# EAGLE design nano_board_v0 (EAGLE 9.6.2)
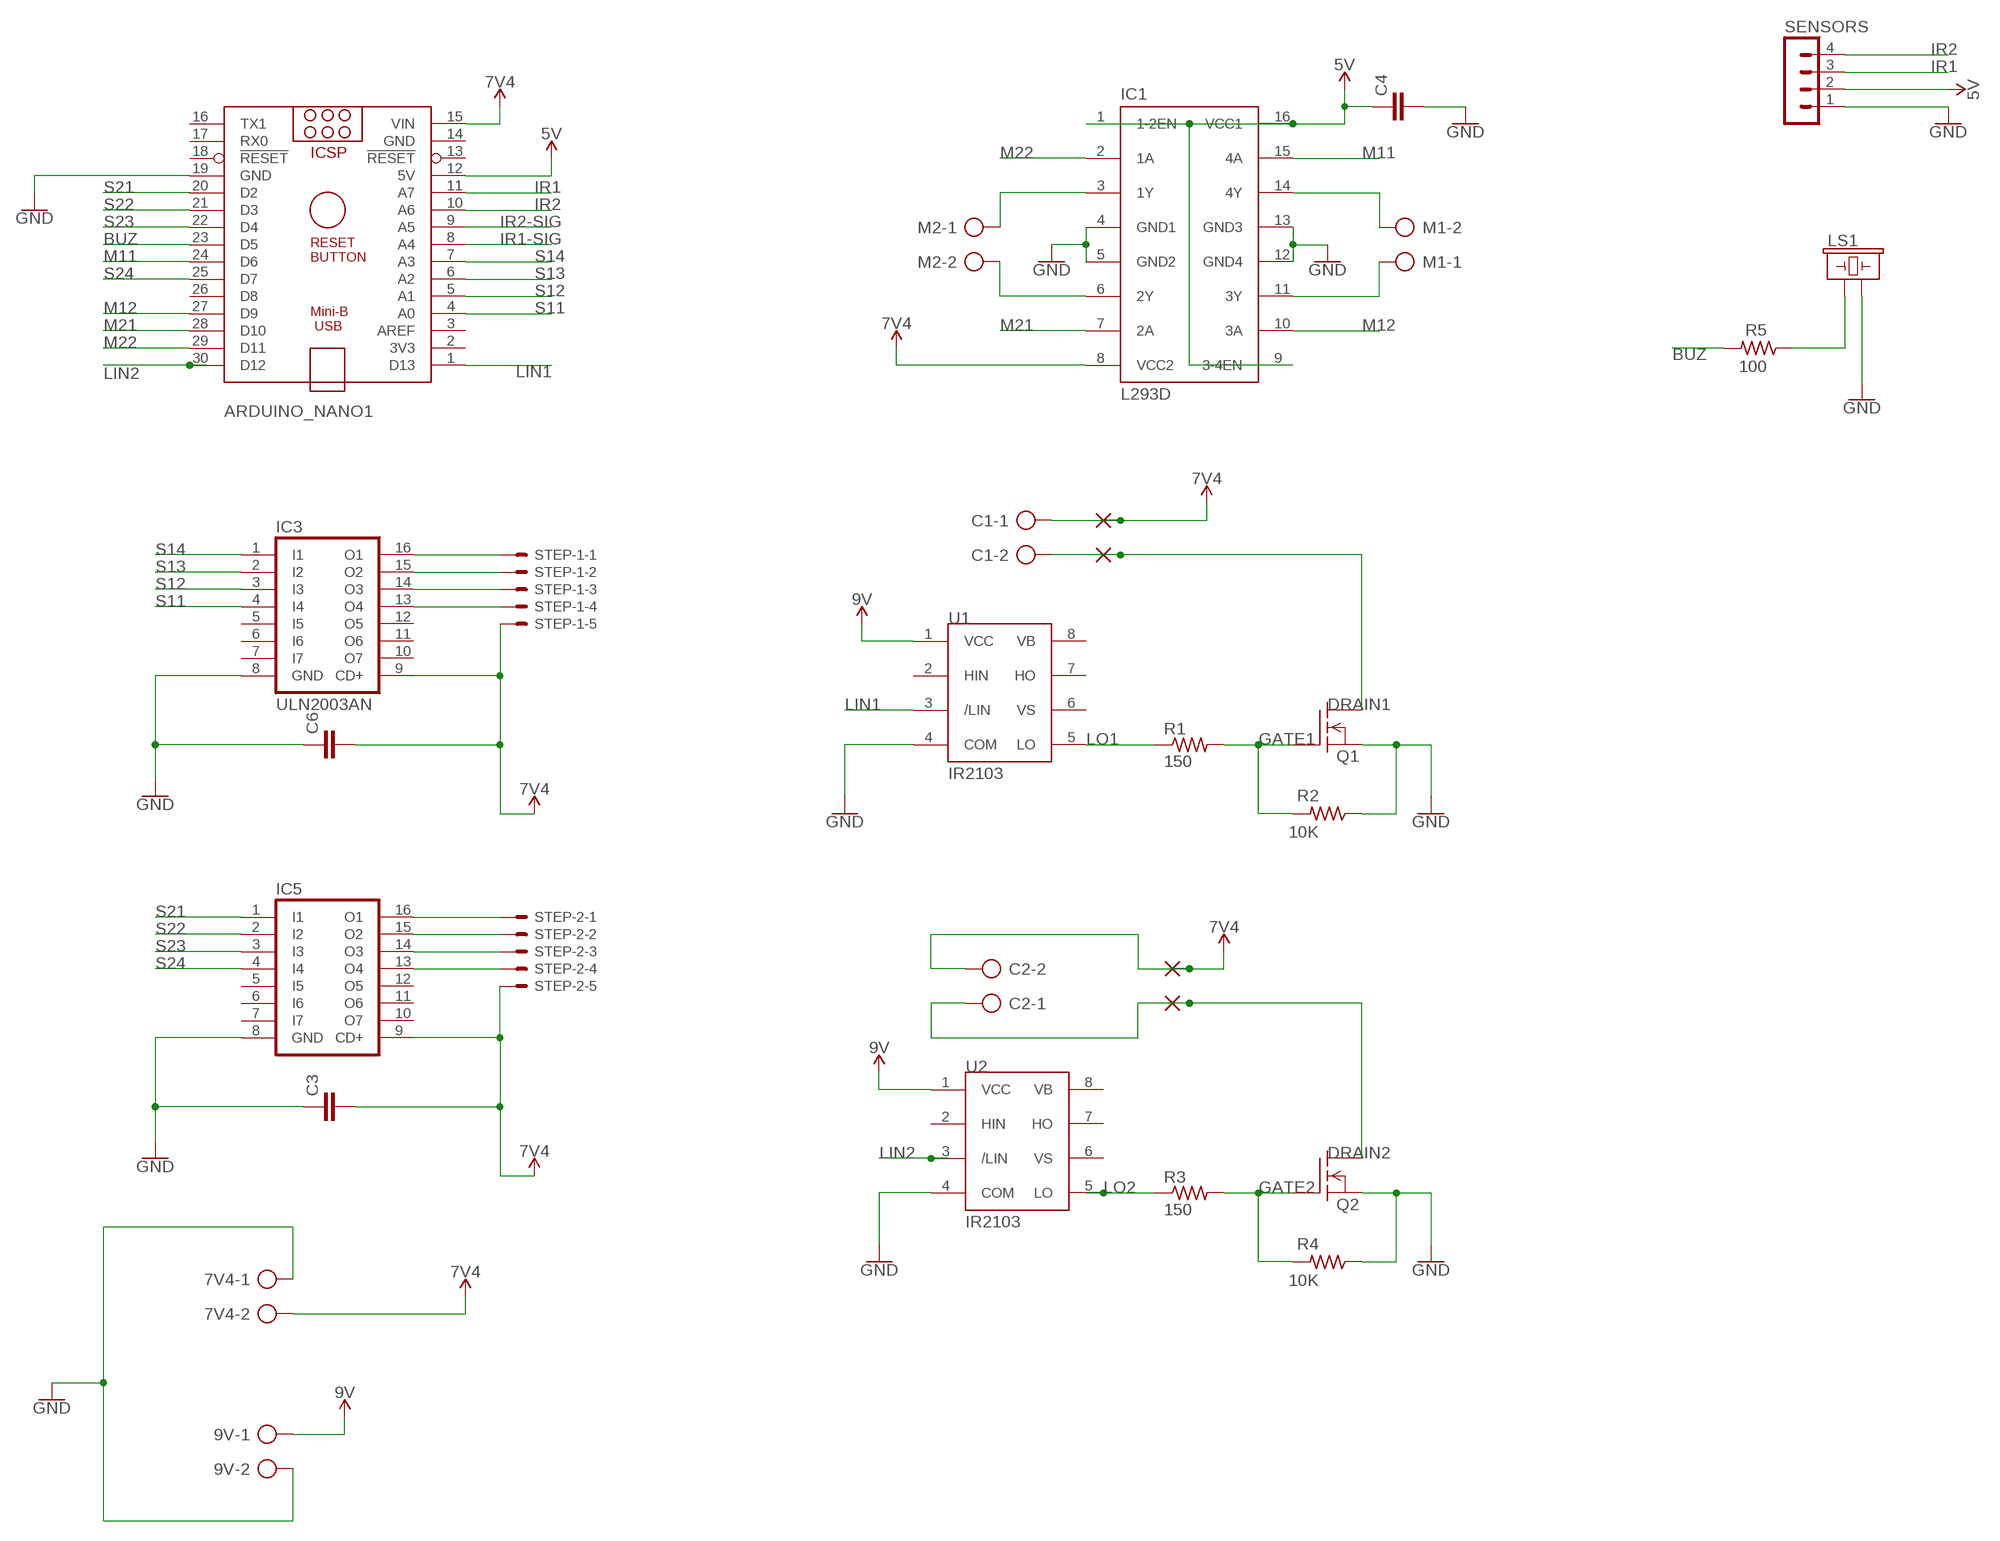
[diagram p0: schematic, sheet 1]

## Parts
7V4  AK500/2  [AK500/2]
9V  AK500/2  [AK500/2]
ARDUINO_NANO1  ARDUINO_NANO  [ARDUINO_NANO]
C1  AK500/2  [AK500/2]
C2  AK500/2  [AK500/2]
C3  C-EU050-025X075  [C050-025X075]
C4  C-EU050-025X075  [C050-025X075]
C6  C-EU050-025X075  [C050-025X075]
IC1  L293D  [DIL16]
IC3  ULN2003AN  [DIL16]
IC5  ULN2003AN  [DIL16]
LS1  BUZZER-PTH_KIT  [BUZZER-12MM-KIT]
M1  AK500/2  [AK500/2]
M2  AK500/2  [AK500/2]
PAD1  WIREPAD2,54/1,1  [2,54/1,1]
PAD2  WIREPAD2,54/1,1  [2,54/1,1]
PAD3  WIREPAD2,54/1,1  [2,54/1,1]
PAD4  WIREPAD2,54/1,1  [2,54/1,1]
Q1  IRF510  [TO220]
Q2  IRF510  [TO220]
R1  150  R-US_0204/7  [0204/7]
R2  10K  R-US_0204/7  [0204/7]
R3  150  R-US_0204/7  [0204/7]
R4  10K  R-US_0204/7  [0204/7]
R5  100  R-US_0204/7  [0204/7]
SENSORS  MA04-1  [MA04-1]
STEP-1  JST-XH-05-PIN-LONG-PAD  [JST-XH-05-PACKAGE-LONG-PAD]
STEP-2  JST-XH-05-PIN-LONG-PAD  [JST-XH-05-PACKAGE-LONG-PAD]
U1  IR2103  [DIL08]
U2  IR2103  [DIL08]

## Nets
1.0V: 9V.1 U1.1(VCC) U2.1(VCC) ; supply symbol labelled 9V
5V: ARDUINO_NANO1.12(5V) C4.1 IC1.1(1-2EN) IC1.9(3-4EN) IC1.16(VCC1) SENSORS.2
12V: 7V4.2 ARDUINO_NANO1.15(VIN) C1.1 C2.2 C3.2 C6.2 IC1.8(VCC2) IC3.9(CD+) IC5.9(CD+) PAD1.1(P) PAD3.1(P) STEP-1.5 STEP-2.5 ; supply symbol labelled 7V4
BUZ: ARDUINO_NANO1.23(D5) R5.2
DRAIN1: C1.2 PAD2.1(P) Q1.2(D)
DRAIN2: C2.1 PAD4.1(P) Q2.2(D)
GATE1: Q1.1(G) R1.2 R2.2
GATE2: Q2.1(G) R3.2 R4.2
GND: 7V4.1 9V.2 ARDUINO_NANO1.19(GND) C3.1 C4.2 C6.1 IC1.4(GND1) IC1.5(GND2) IC1.12(GND4) IC1.13(GND3) IC3.8(GND) IC5.8(GND) LS1.- Q1.3(S) Q2.3(S) R2.1 R4.1 SENSORS.1 U1.4(COM) U2.4(COM)
IR1: ARDUINO_NANO1.11(A7) SENSORS.3
IR1-SIG: ARDUINO_NANO1.8(A4)
IR2: ARDUINO_NANO1.10(A6) SENSORS.4
IR2-SIG: ARDUINO_NANO1.9(A5)
LIN1: ARDUINO_NANO1.1(D13) U1.3(/LIN)
LIN2: ARDUINO_NANO1.30(D12) U2.3(/LIN)
LO1: R1.1 U1.5(LO)
LO2: R3.1 U2.5(LO)
M11: ARDUINO_NANO1.24(D6) IC1.15(4A)
M12: ARDUINO_NANO1.27(D9) IC1.10(3A)
M21: ARDUINO_NANO1.28(D10) IC1.7(2A)
M22: ARDUINO_NANO1.29(D11) IC1.2(1A)
N$4: IC3.16(O1) STEP-1.1
N$5: IC3.15(O2) STEP-1.2
N$6: IC1.14(4Y) M1.2
N$7: IC1.11(3Y) M1.1
N$8: IC1.3(1Y) M2.1
N$9: IC1.6(2Y) M2.2
N$12: IC3.14(O3) STEP-1.3
N$13: IC3.13(O4) STEP-1.4
N$14: IC5.16(O1) STEP-2.1
N$15: IC5.15(O2) STEP-2.2
N$18: LS1.+ R5.1
N$19: IC5.14(O3) STEP-2.3
N$20: IC5.13(O4) STEP-2.4
S11: ARDUINO_NANO1.4(A0) IC3.4(I4)
S12: ARDUINO_NANO1.5(A1) IC3.3(I3)
S13: ARDUINO_NANO1.6(A2) IC3.2(I2)
S14: ARDUINO_NANO1.7(A3) IC3.1(I1)
S21: ARDUINO_NANO1.20(D2) IC5.1(I1)
S22: ARDUINO_NANO1.21(D3) IC5.2(I2)
S23: ARDUINO_NANO1.22(D4) IC5.3(I3)
S24: ARDUINO_NANO1.25(D7) IC5.4(I4)
Unconnected: ARDUINO_NANO1.2(3V3) ARDUINO_NANO1.3(AREF) ARDUINO_NANO1.13(!RESET) ARDUINO_NANO1.16(TX1) ARDUINO_NANO1.17(RX0) ARDUINO_NANO1.18(!RESET) ARDUINO_NANO1.26(D8) IC3.5(I5) IC3.6(I6) IC3.7(I7) IC3.10(O7) IC3.11(O6) IC3.12(O5) IC5.5(I5) IC5.6(I6) IC5.7(I7) IC5.10(O7) IC5.11(O6) IC5.12(O5) U1.2(HIN) U1.6(VS) U1.7(HO) U1.8(VB) U2.2(HIN) U2.6(VS) U2.7(HO) U2.8(VB)

## Power pins joined to a net without a drawn wire
GND: ARDUINO_NANO1.14(GND)

## Library data of the parts
7V4 9V C1 C2 M1 M2 = con-ptr500:AK500/2: CONNECTOR; OC_FARNELL: unknown; OC_NEWARK: unknown
ARDUINO_NANO1 = ArduinoNanoV30:ARDUINO_NANO: Arduino Nano V3.0 Overview: The Arduino Nano is a small, complete, and breadboard-friendly board based on the ATmega328 (Arduino Nano 3.x) or ATmega168 (Arduino Nano 2.x). It has more or less the same functionality of the Arduino Duemilanove, but in a different package. It lacks only a DC power jack, and works with a Mini-B USB cable instead of a standard one. The Nano was designed and is being produced by Gravitech. Specifications: Microcontroller Atmel ATmega168 or ATmega328 Operating Voltage (logic level) 5 V Input Voltage (recommended) 7-12 V Input Voltage (limits) 6-20 V Digital I/O Pins 14 (of which 6 provide PWM output) Analog Input Pins 8 DC Current per I/O Pin 40 mA Flash Memory 16 KB (ATmega168) or 32 KB (ATmega328) of which 2 KB used by bootloader SRAM 1 KB (ATmega168) or 2 KB (ATmega328) EEPROM 512 bytes (ATmega168) or 1 KB (ATmega328) Clock Speed 16 MHz Dimensions 0.73" x 1.70" Length 45 mm Width 18 mm Weigth 5 g Power: The Arduino Nano can be powered via the Mini-B USB connection, 6-20V unregulated external power supply (pin 30), or 5V regulated external power supply (pin 27). The power source is automatically selected to the highest voltage source. Memory: The ATmega168 has 16 KB of flash memory for storing code (of which 2 KB is used for the bootloader); the ATmega328 has 32 KB, (also with 2 KB used for the bootloader). The ATmega168 has 1 KB of SRAM and 512 bytes of EEPROM (which can be read and written with the EEPROM library); the ATmega328 has 2 KB of SRAM and 1 KB of EEPROM. Input and Output: Each of the 14 digital pins on the Nano can be used as an input or output, using pinMode(), digitalWrite(), and digitalRead() functions. They operate at 5 volts. Each pin can provide or receive a maximum of 40 mA and has an internal pull-up resistor (disconnected by default) of 20-50 kOhms. In addition, some pins have specialized functions. Visit Arduino - ArduinoBoardNano <https://www.arduino.cc/en/Main/ArduinoBoardNano>
C3 C4 C6 = rcl:C-EU: CAPACITOR, European symbol; SPICEPREFIX: C
IC1 = st-microelectronics:L293D: PUSH-PULL 4 CHANNEL DRIVER; MPN: L293D; OC_FARNELL: 9589619; OC_NEWARK: 56P8249
IC3 IC5 = uln-udn:ULN2003A: DRIVER ARRAY
LS1 = SparkFun-Electromechanical:BUZZER: Buzzer Small round buzzers that operate around the audible 2kHz range. You can use these as speakers to create simple music or user interfaces. Variant Overview: PTH - Mini Speaker - PC Mount 12mm 2.048kHz <https://www.sparkfun.com/products/7950> PTH_KIT - Mini Speaker - PC Mount 12mm 2.048kHz <https://www.sparkfun.com/products/7950> KIT simplifies soldering by adding stop mask to one side of the pads. PTH_NO_SILK - Mini Speaker - PC Mount 12mm 2.048kHz <https://www.sparkfun.com/products/7950> No silkscreen indicator of buzzer outline. PTH_KIT_NO_SILK - Mini Speaker - PC Mount 12mm 2.048kHz <https://www.sparkfun.com/products/7950> KIT package w/o silkscreen SMD - Buzzer Audio Magnetic (CCV-084B16) SMD buzzer used on, e.g. the LilyPad Buzzer <https://www.sparkfun.com/products/8463> and RFID USB Reader <https://www.sparkfun.com/products/9963>. SMD_KIT - Buzzer Audio Magnetic (CCV-084B16) SMD Buzzer with elongated pins to make soldering easier. Used on the SparkFun Simon Says - Surface Mount Soldering Kit <https://www.sparkfun.com/products/10935>.; PROD_ID: COMP-08253; SF_SKU: COM-07950
PAD1-PAD4 = wirepad:WIREPAD: Wire PAD connect wire on PCB
Q1 Q2 = transistor-fet(IRF510 LONGER LEGS):IRF510: N-Channel Enhancement MOSFET (HEXFET); 100V; 5,6A; 0,54Ohm
R1-R5 = rcl:R-US_: RESISTOR, American symbol; SPICEPREFIX: R
SENSORS = con-lstb:MA04-1: PIN HEADER; OC_FARNELL: unknown; OC_NEWARK: unknown
STEP-1 STEP-2 = JST XH Connectors v1-0:JST-XH-05-PIN: JST XH Connector 2 Pin Wire to board connector. Pitch: 2,54 mm, (0.100") Number of pins: 5 Created by Rembrandt Electronics www.rembrandtelectronics.com
U1 U2 = irf:IR2103: High and low side driver

## Board
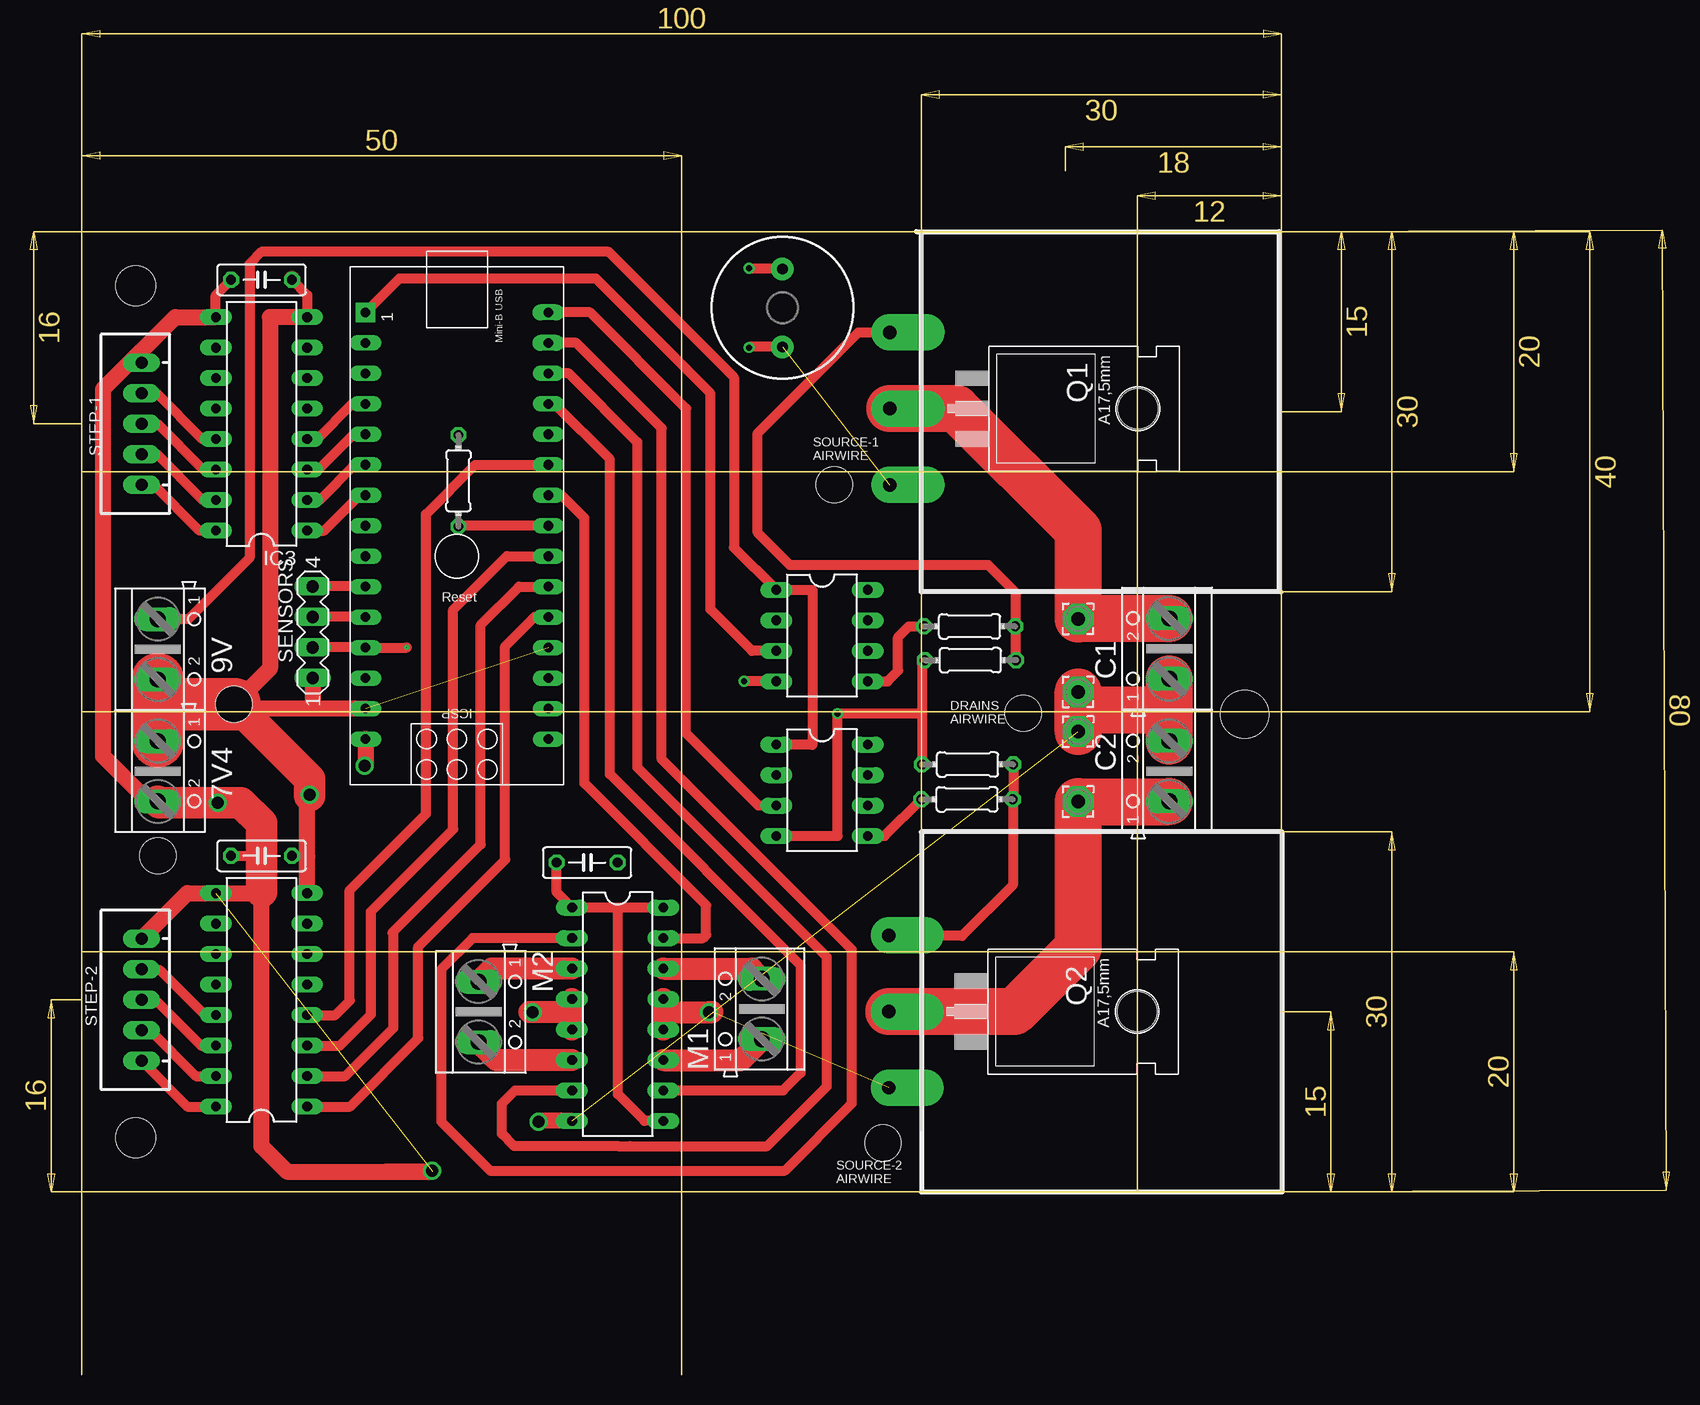
[diagram p1: board, top side]
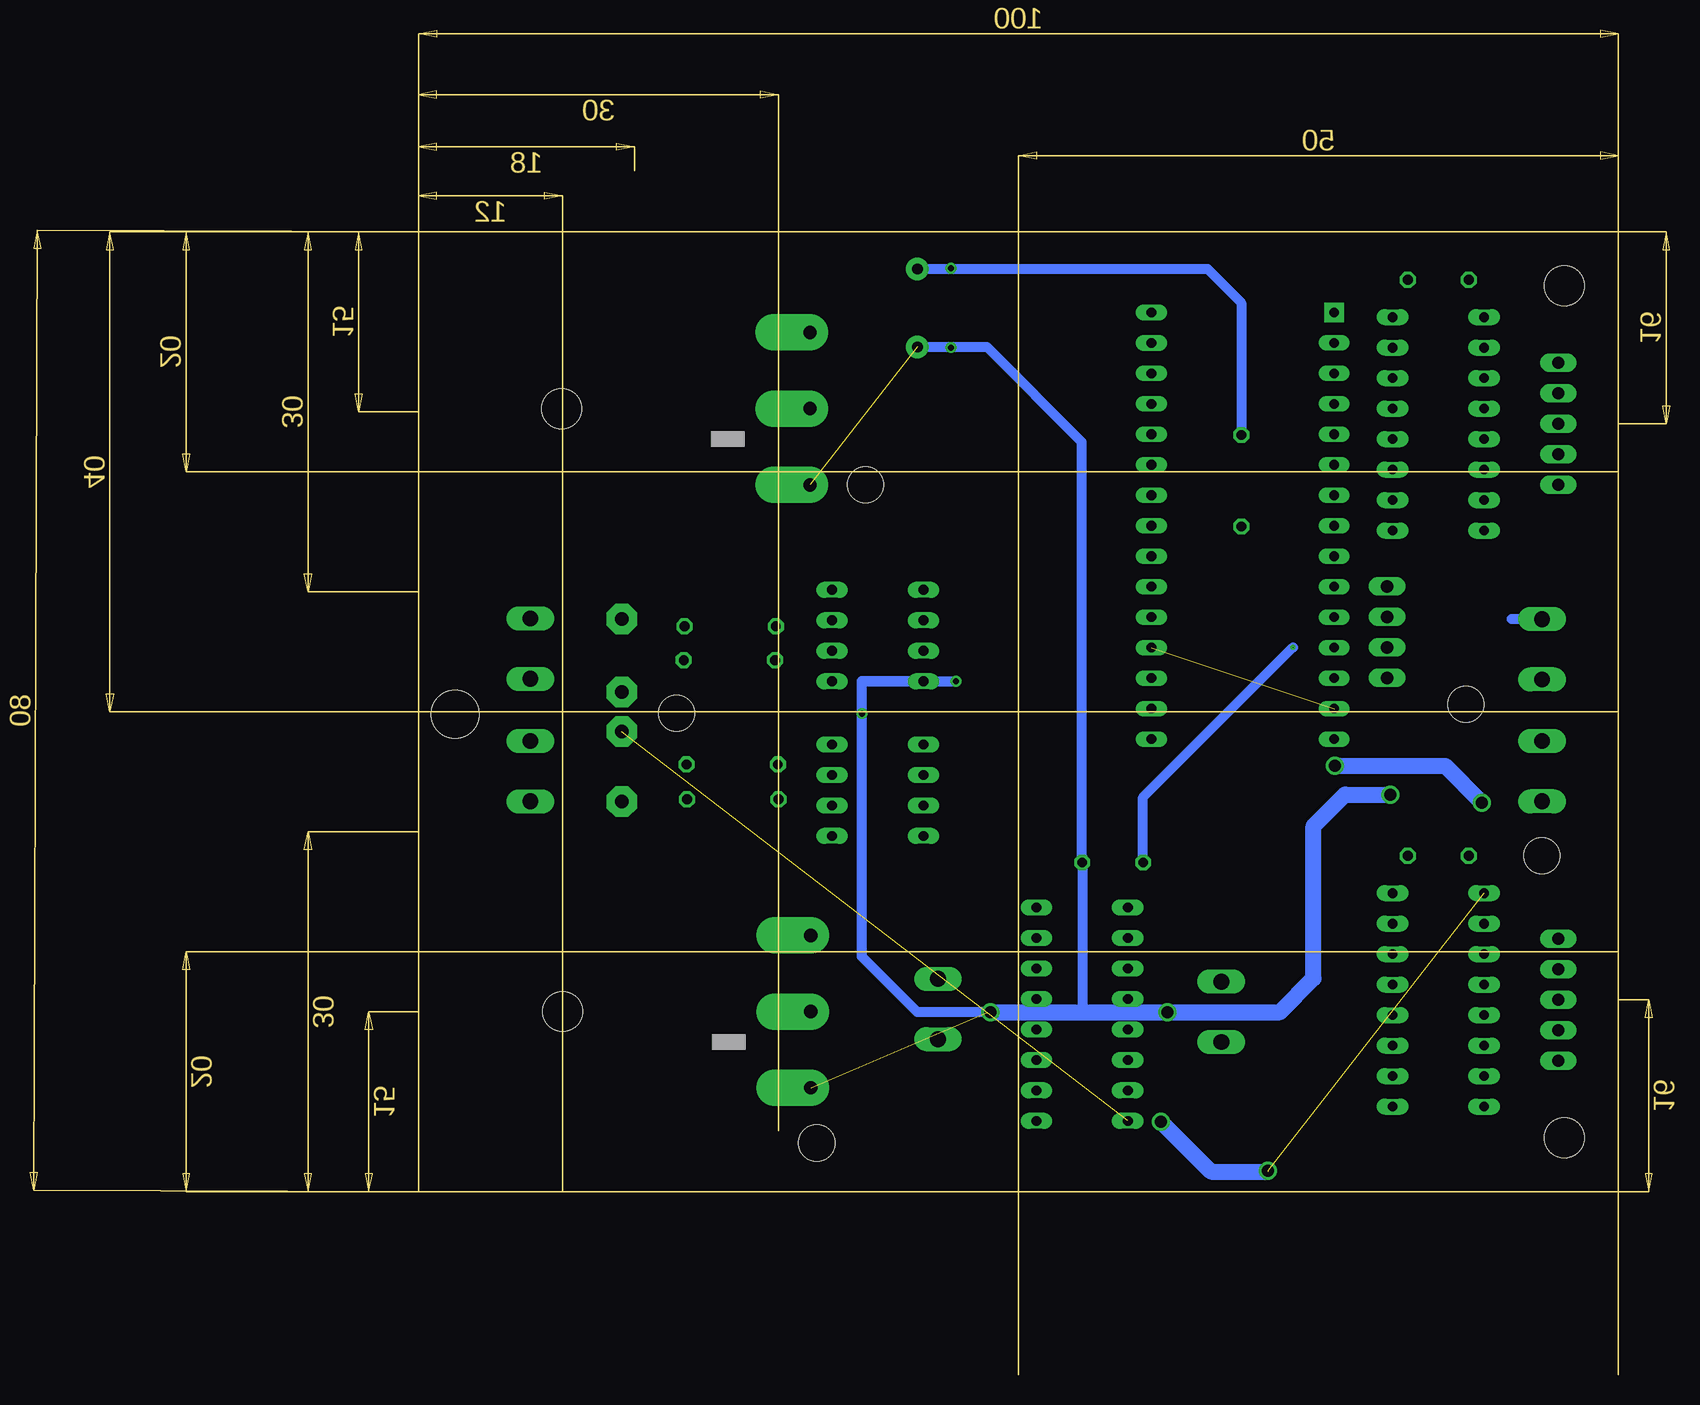
[diagram p2: board, bottom side, seen from below]

Size 100 x 80 mm. Coordinates in mm from the lower left corner, seen from the top.
Outline: 0,0 100,0 100,80 0,80 0,0
Copper layers (1*16): Top 0.035mm / dielectric 1.5mm / Bottom 0.035mm
Design rules "default": minimum track width 6mil, minimum drill 0.35mm, track to track 6mil, track to pad 6mil, pad to pad 6mil, via to via 6mil, smd to smd 6mil, copper to edge 40mil, drill to drill 6mil, minimum pad ring 10mil, minimum via ring 8mil, stop-mask expansion 4mil, vias tented up to drill 0mil, thermal gap 10mil
Holes 3.3 mm at 4.5,75.5 4.5,4.5
Holes 3 mm at 78.49,39.88 66.8,4.06 62.74,58.93 12.7,40.64 6.37,28
Holes 4 mm at 96.96,39.81

### Footprints (pad centres in the part's own frame; a part is rotated, then mirrored left to right if it is on the bottom)
AK500/2 = drill 1.321 long: 1 -2.515,0; 2 2.515,0
ARDUINO_NANO = drill 0.8 pad 1.626 square: 1 -20.32,-7.62 | drill 0.8 long: 2 -17.78,-7.62; 3 -15.24,-7.62; 4 -12.7,-7.62; 5 -10.16,-7.62; 6 -7.62,-7.62; 7 -5.08,-7.62; 8 -2.54,-7.62; 9 0,-7.62; 10 2.54,-7.62; 11 5.08,-7.62; 12 7.62,-7.62; 13 10.16,-7.62; 14 12.7,-7.62; 15 15.24,-7.62; 16 15.24,7.62; 17 12.7,7.62; 18 10.16,7.62; 19 7.62,7.62; 20 5.08,7.62; 21 2.54,7.62; 22 0,7.62; 23 -2.54,7.62; 24 -5.08,7.62; 25 -7.62,7.62; 26 -10.16,7.62; 27 -12.7,7.62; 28 -15.24,7.62 | drill 0.8 pad 1.321 long: 29 -17.78,7.62; 30 -20.32,7.62
C050-025X075 = drill 0.813 octagon: 1 -2.54,0; 2 2.54,0
DIL16 = drill 0.813 long: 1 -8.89,-3.81; 2 -6.35,-3.81; 3 -3.81,-3.81; 4 -1.27,-3.81; 5 1.27,-3.81; 6 3.81,-3.81; 7 6.35,-3.81; 8 8.89,-3.81; 9 8.89,3.81; 10 6.35,3.81; 11 3.81,3.81; 12 1.27,3.81; 13 -1.27,3.81; 14 -3.81,3.81; 15 -6.35,3.81; 16 -8.89,3.81
BUZZER-12MM-KIT = drill 0.9 pad 1.88: + 3.25,0; - -3.25,0
2,54/1,1 = drill 1.118 pad 2.54 octagon: 1 0,0
TO220 = drill 1.118 pad 3.048 offset: 1 -6.35,-9.525; 2 0,-9.525; 3 6.35,-9.525 | hole 3.302: 0,11.176
0204/7 = drill 0.813 octagon: 1 -3.81,0; 2 3.81,0
MA04-1 = drill 1.016 long: 1 -3.81,0; 2 -1.27,0; 3 1.27,0; 4 3.81,0
JST-XH-05-PACKAGE-LONG-PAD = drill 1.016 long: 1 -5.08,0; 2 -2.54,0; 3 0,0; 4 2.54,0; 5 5.08,0
DIL08 = drill 0.813 long: 1 -3.81,-3.81; 2 -1.27,-3.81; 3 1.27,-3.81; 4 3.81,-3.81; 5 3.81,3.81; 6 1.27,3.81; 7 -1.27,3.81; 8 -3.81,3.81

### Placement (x,y rotation side)
7V4  6.35,35.05 270 top
9V  6.35,45.21 270 top
ARDUINO_NANO1  31.29,52.97 270 top
C1  90.68,45.27 90 top
C2  90.68,35.06 90 top
C3  15,76 180 top
C4  42.14,27.44 0 top
C6  15,28 180 top
IC1  44.69,14.8 270 top
IC3  15,64 90 top
IC5  15,16 90 top
LS1  58.42,73.66 90 top
M1  56.71,15.24 90 top
M2  33.09,15 270 top
PAD1  83.06,41.66 0 top
PAD2  83.06,47.75 0 top
PAD3  83.06,38.35 0 top
PAD4  83.06,32.51 0 top
Q1  76.89,65.27 270 top
Q2  76.81,15.02 270 top
R1  74.02,47.13 0 top
R2  74.09,44.31 0 top
R3  73.81,32.71 0 top
R4  73.86,35.62 0 top
R5  31.41,59.25 270 top
SENSORS  19.27,46.64 90 top
STEP-1  5,64 90 top
STEP-2  5,16 90 top
U1  61.72,46.35 270 top
U2  61.72,33.47 270 top

### Tracks (layer width: path | path; a pad name or v marks a point on that pad's centre or on a via)
1.0V
  Top 0.813: 9V.1 8.89,47.73 14,52.84 14,77.34 14.99,78.32 43.94,78.32 54.38,67.88 54.38,53.69 U1.1 60.92,50.16 60.92,37.24 57.91,37.24 U2.1
  Bottom 0.813: 9V.1 8.89,47.73
5V  (via drill 0.01)
  Top 0.813: IC1.16 44.7,23.69 | 44.7,23.69 IC1.1 | IC1.9 46.93,5.91 44.7,8.13 44.7,23.69 | v27.1,45.36 27.09,45.35 ARDUINO_NANO1.12 23.65,45.37 SENSORS.2 | IC1.1 40.69,23.87 | IC1.1 39.6,24.96 C4.1
  Bottom 0.813: v27.1,45.36 39.6,32.87 C4.1
12V  (via drill 1)  (3 unrouted)
  Top 0.813: C6.2 14.94,28 15,27.94 | IC5.9 14.89,24.89 15,25 | IC3.9 11.19,74.73 C3.2
  Top 1.321: IC1.8 38.16,5.91 v38.1,5.84 | 25.4,1.68 17.12,1.68 15,3.8 15,25 | 25.4,1.68 29.21,1.68 25.4,1.68 | 7V4.2 5.56,32.54 1.78,36.32 1.78,66.88 4.98,70.08 5,70.08 | 5,70.08 7.81,72.89 IC3.9 | 5,70.08 STEP-1.5 4,69.08 5,70.08 | 14.73,24.89 15.24,25.4 15.24,25.24 15,25 | ARDUINO_NANO1.15 23.67,35.57 v23.6,35.5 | STEP-2.5 8.81,24.89 IC5.9 14.73,24.89 | 14.73,24.89 14.89,24.89 15,25
  Top 2.642: 15,25 15,27.94 15,30.7 13.26,32.44 v11.36,32.44 6.45,32.44 7V4.2
  Top 3.912: C2.2 90.68,40.13 | 90.68,40.13 C1.1 | 90.68,40.13 83.06,40.13 | 83.06,40.13 PAD1.1 | PAD3.1 83.06,40.13
  Bottom 1.321: v38.1,5.84 33.93,1.68 29.21,1.68 | v23.6,35.5 14.42,35.5 v11.36,32.44
  other vias: 29.21,1.78
BUZ
  Top 0.813: ARDUINO_NANO1.23 38.9,55.49 31.46,55.49 R5.2
DRAIN1
  Top 3.912: Q1.2 72.91,65.27 83.06,55.12 PAD2.1 83.09,47.78 C1.2
DRAIN2
  Top 3.912: C2.1 90.65,32.51 PAD4.1 83.06,20.32 77.76,15.02 Q2.2
GATE1
  Top 0.813: Q1.1 64.76,71.62 56.36,63.22 56.36,54.93 59.05,52.23 75.58,52.23 77.9,49.92 R2.2 77.9,47.06 R1.2
GATE2
  Top 0.813: Q2.1 67.33,21.34 73.41,21.34 77.62,25.55 R3.2 77.67,32.76 R4.2
GND  (via drill 0.5, 1)  (3 unrouted)
  Top 0.813: R2.1 70.05,44.08 70.05,39.86 | 70.05,39.86 R4.1 | LS1.- 55.63,70.41 v55.63,70.36 | C6.1 18.75,28 18.81,27.94 | C3.1 18.81,74.73 IC3.8 | 70.05,39.86 v63.02,39.86 63.02,29.66 U2.4 | U1.4 v55.21,42.55
  Top 1.321: 17.55,76.07 C3.1 | IC3.8 15.72,72.89 15.72,43.62 12.74,40.64 | IC5.8 18.81,27.94 18.81,34.21 19,34.4 | ARDUINO_NANO1.14 19.3,40.27 | 19.3,40.27 10.97,40.27 10.6,40.64 | SENSORS.1 19.27,40.3 19.3,40.27
  Top 1.829: IC1.13 48.5,14.99 | 48.5,14.99 IC1.12 | IC1.4 40.88,14.99 | 40.88,14.99 IC1.5 | 48.5,14.99 v52.32,14.99 52.58,14.99 | 40.88,14.99 v37.59,14.99 37.34,14.99
  Top 2.642: 9V.2 6.35,40.64 | 7V4.1 6.35,40.64 | 6.35,40.64 10.6,40.64 12.74,40.64 12.76,40.64 19,34.4 v19,33.1 19,33.02
  Top 4.369: 6.35,40.64 12.76,40.64 | 7V4.1 9V.2
  Bottom 0.813: v37.59,14.99 37.77,14.81 | 52.15,14.81 v52.32,14.99 58.42,14.99 63.04,19.61 63.04,39.86 | LS1.- 52.63,70.41 44.7,62.48 44.7,27.94 44.68,27.92 C4.2 44.68,15.17 44.5,14.99 | 63.04,39.86 v63.02,39.86 | U1.4 63.04,42.55 | 63.04,39.86 63.04,42.55 | 63.04,42.55 v55.21,42.55
  Bottom 1.321: v19,33.1 22.78,33.1 25.4,30.48 25.4,17.78 28.19,14.99 v37.59,14.99 44.5,14.99 v52.32,14.99
IR1
  Top 0.813: ARDUINO_NANO1.11 23.65,47.91 SENSORS.3
IR2
  Top 0.813: ARDUINO_NANO1.10 23.65,50.45 SENSORS.4
LIN1
  Top 0.813: ARDUINO_NANO1.1 26.48,76.1 42.87,76.1 52.42,66.55 52.42,48.55 55.88,45.09 U1.3
LIN2
  Top 0.813: ARDUINO_NANO1.30 42.38,73.29 50.39,65.28 50.39,38.23 56.42,32.2 U2.3
LO1
  Top 0.813: U1.5 67.18,42.55 68.07,43.43 68.07,46.23 68.97,47.12 R1.1
LO2
  Top 0.813: U2.5 66.95,29.66 R3.1
M11
  Top 0.813: IC1.15 51.8,21.15 52.07,21.41 52.07,23.88 41.91,34.04 41.91,56.13 40,58.05 ARDUINO_NANO1.24
M12
  Top 0.813: IC1.10 58.48,8.45 59.94,9.91 59.94,18.89 44.04,34.8 44.04,61.04 39.41,65.67 ARDUINO_NANO1.27
M21
  Top 0.813: ARDUINO_NANO1.28 40.6,68.21 46.32,62.48 46.32,35.36 62.13,19.56 62.13,8.79 57.15,3.81 45.72,3.81 44.7,3.81 36.07,3.81 35.05,4.83 35.05,7.37 36.13,8.45 IC1.7
M22
  Top 0.813: IC1.2 32.58,21.15 29.97,18.54 29.97,5.84 34.04,1.78 58.62,1.78 64.21,7.37 64.21,20.19 48.36,36.04 48.36,63.63 41.23,70.75 ARDUINO_NANO1.29
N$4
  Top 0.813: IC3.16 9.81,55.11 6,58.92 STEP-1.1
N$5
  Top 0.813: STEP-1.2 5.04,61.5 6.26,61.5 10.11,57.65 IC3.15
N$6
  Top 1.829: IC1.14 55.85,18.61 M1.2
N$7
  Top 1.829: IC1.11 54.97,10.99 M1.1
N$8
  Top 1.829: IC1.3 34.18,18.61 M2.1
N$9
  Top 1.829: IC1.6 34.58,10.99 M2.2
N$12
  Top 0.813: STEP-1.3 6.34,64 10.15,60.19 IC3.14
N$13
  Top 0.813: STEP-1.4 6.26,66.54 10.07,62.73 IC3.13
N$14
  Top 0.813: STEP-2.1 8.81,7.11 IC5.16
N$15
  Top 0.813: STEP-2.2 5.72,13.46 9.53,9.65 IC5.15
N$18  (via drill 0.5)
  Top 0.813: LS1.+ 55.63,76.91 v55.63,76.96
  Bottom 0.813: LS1.+ 34.24,76.91 31.41,74.08 R5.1
N$19
  Top 0.813: STEP-2.3 6.14,16 9.95,12.19 IC5.14
N$20
  Top 0.813: STEP-2.4 5.04,18.5 6.5,18.5 10.5,14.5 10.96,14.5 IC5.13
S11
  Top 0.813: IC3.4 19.64,62.73 22.57,65.67 ARDUINO_NANO1.4
S12
  Top 0.813: IC3.3 19.73,60.19 22.67,63.13 ARDUINO_NANO1.5
S13
  Top 0.813: IC3.2 19.84,57.65 22.77,60.59 ARDUINO_NANO1.6
S14
  Top 0.813: IC3.1 20.23,55.11 23.17,58.05 ARDUINO_NANO1.7
S21
  Top 0.813: ARDUINO_NANO1.20 37.73,47.89 35.31,45.47 35.31,27.69 28.06,20.44 28.06,12.8 22.37,7.11 IC5.1
S22
  Top 0.813: ARDUINO_NANO1.21 36.46,50.43 33.27,47.24 33.27,28.96 25.91,21.59 26,21.5 26,13.66 21.99,9.65 IC5.2
S23
  Top 0.813: ARDUINO_NANO1.22 35.44,52.97 30.99,48.51 30.99,30.23 24.13,23.37 24.13,14.79 21.53,12.19 IC5.3
S24
  Top 0.813: ARDUINO_NANO1.25 32.82,60.59 28.7,56.47 28.7,31.5 22.35,25.15 22.35,15.93 21.15,14.73 IC5.4

### Text on the board
tNames: SOURCE-1 / AIRWIRE | DRAINS / AIRWIRE | SOURCE-2 / AIRWIRE